# EasyEDA schematic child_easyeda.json
TITLE: Child Node, Wireless BMS; REV: 1.0; Date: 2023-08-22; Sheet: 1/1; Drawn By: Mathew Pellarin; Company: BMSLAB
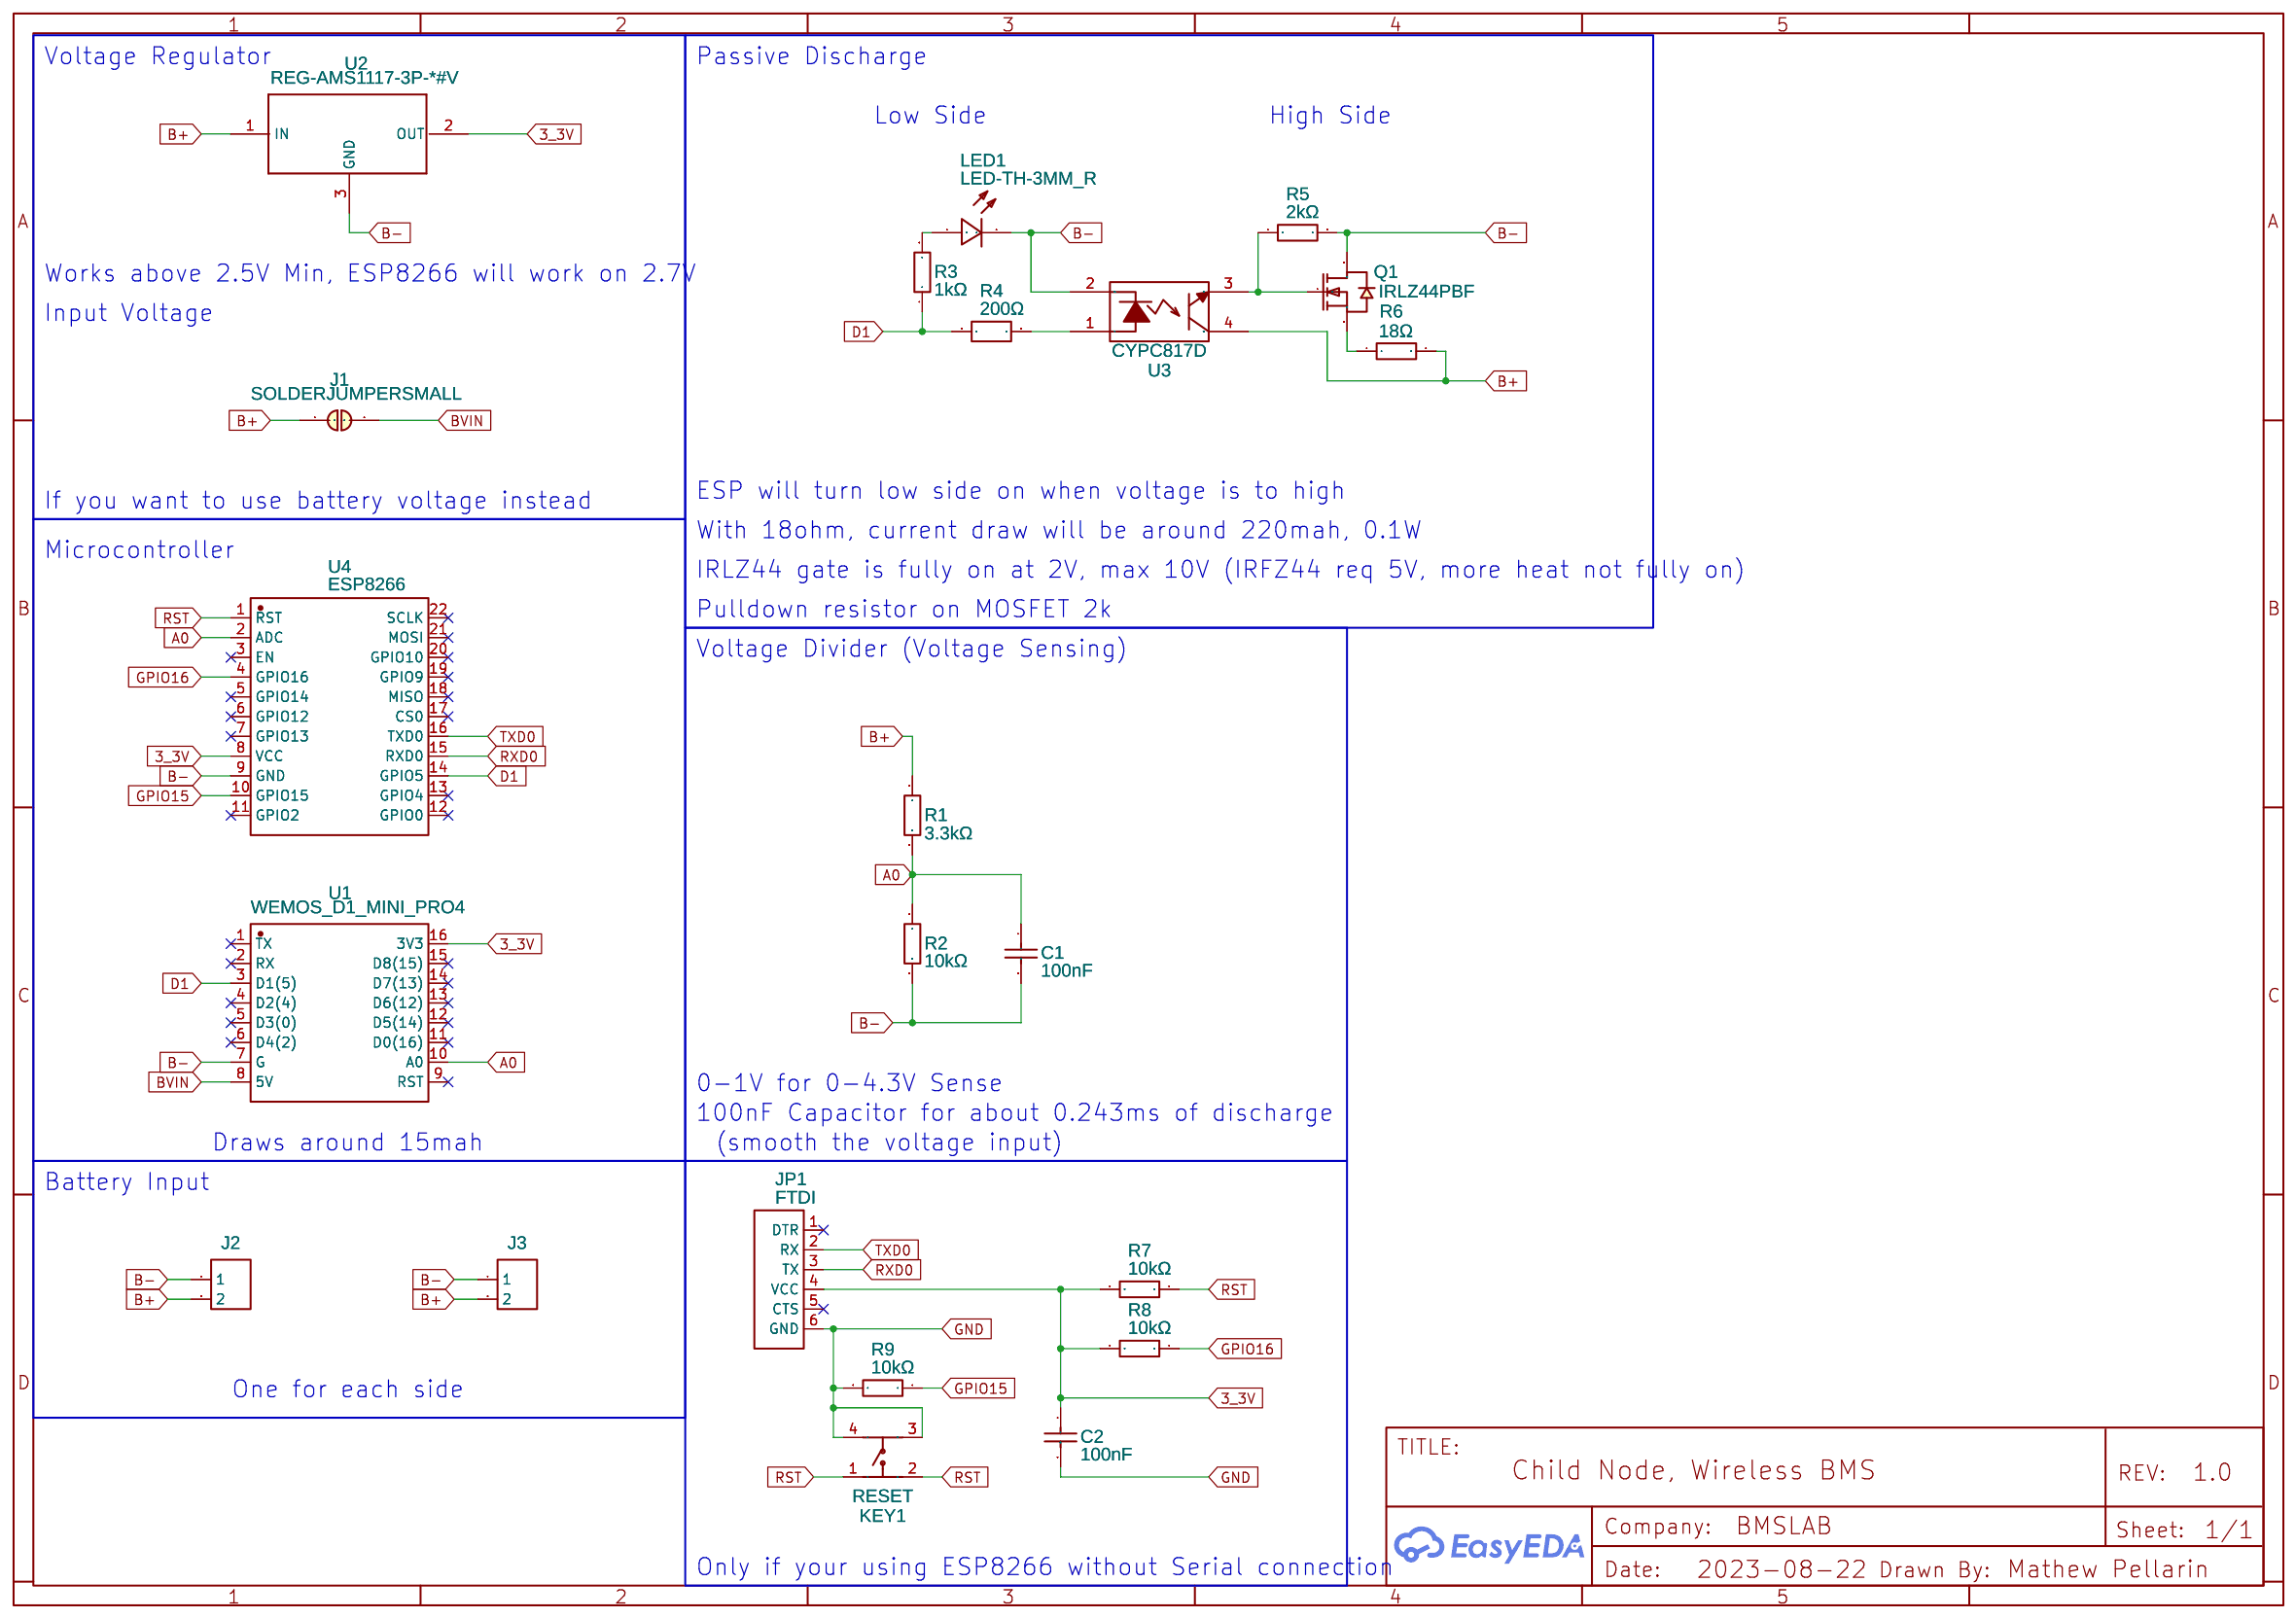
[diagram p0: schematic sheet]

## Parts
C1  100nF  [CAP-TH_L7.6-W3.8-P5.08-D0.51]
C2  100nF  [CAP-TH_L7.6-W3.8-P5.08-D0.51]
J1  SOLDERJUMPERSMALL  [SOLDERJUMPERSMALL]
J2  NO  [CONNECTOR_PINHEADER_2.54MM:PINHEADER_1X11_P_2.54MM]
J3  NO  [CONNECTOR_PINHEADER_2.54MM:PINHEADER_1X11_P_2.54MM]
JP1  FTDI  [FTDI]
KEY1  RESET  [KEY-TH_4P-L6.0-W6.0-P4.50-LS7.5]
LED1  LED-TH-3MM_R  [LED-TH_BD5.4-P2.54-FD_RED]
Q1  IRLZ44PBF  [TO-220AB-3_L10.4-W4.6-P2.54-L]
R1  3.3kΩ  [RES-TH_BD2.4-L6.3-P10.30-D0.6]
R2  10kΩ  [RES-TH_BD2.2-L6.5-P10.50-D0.6]
R3  1kΩ  [RES-TH_BD2.4-L6.3-P10.30-D0.6]
R4  200Ω  [RES-TH_BD2.7-L6.2-P10.20-D0.4]
R5  2kΩ  [RES-TH_BD2.4-L6.3-P10.30-D0.6]
R6  18Ω  [RES-TH_BD2.3-L6.5-P10.50-D0.5]
R7  10kΩ  [RES-TH_BD2.4-L6.3-P10.30-D0.6]
R8  10kΩ  [RES-TH_BD2.4-L6.3-P10.30-D0.6]
R9  10kΩ  [RES-TH_BD2.4-L6.3-P10.30-D0.6]
U1  WEMOS_D1_MINI_PRO4  [DIP-16_WEMOS_D1_MINI_PRO4]
U2  REG-AMS1117-3P-*#V  [REG-AMS1117-3P#V]
U3  CYPC817D  [DIP-4_L6.4-W4.6-P2.54-LS7.6-BL]
U4  ESP8266  [WIFIM-SMD_ESP-12F-ESP8266MOD]

## Library data of the parts
C1 C2 = SR305C105KAR: Contributor: LCSC; Supplier: LCSC; Supplier Part: C444741; Manufacturer: Kyocera AVX; JLCPCB Part Class: Extended Part; link: https://lcsc.com/eda_search?q=C444741&%26type=1&ref=editor
J1 = SOLDERJUMPERSMALL: Contributor: stefan.klaeui
J2 J3 = Header-Female-2.54_1x2: Supplier: LCSC; Manufacturer: BOOMELE; Manufacturer Part: Female headerHDR1X8-2.54; Supplier Part: C27438; JLCPCB Part Class: Extended Part; Contributor: Jacob KUNNATHOOR
JP1 = FTDI: Contributor: SparkFun
KEY1 = button6*6*8: Supplier Part: C59982; Supplier: LCSC; Manufacturer: ReliaPro; JLCPCB Part Class: Extended Part; link: https://lcsc.com/eda_search?q=C59982&%26type=1&ref=editor
LED1 = LED-TH-3MM_R: Contributor: LCSC; Supplier: LCSC; Supplier Part: C9900003210; Manufacturer: null; Manufacturer Part: LED-TH-3mm_R; JLCPCB Part Class: Extended Part; link: https://lcsc.com/eda_search?q=C9900003210&%26type=1&ref=editor
Q1 = IRLZ44PBF: Contributor: LCSC; Supplier: LCSC; Supplier Part: C2680731; Manufacturer: VBsemi(微碧); Manufacturer Part: IRLZ44PBF-VB; JLCPCB Part Class: Extended Part; link: https://lcsc.com/eda_search?q=C2680731&%26type=1&ref=editor
R1 R7-R9 = MFR-25FTE52-33K: Contributor: LCSC; Supplier: LCSC; Supplier Part: C173005; Manufacturer: YAGEO(国巨); JLCPCB Part Class: Extended Part; link: https://lcsc.com/eda_search?q=C173005&%26type=1&ref=editor
R2 = MFR-25FTE52-100K: Contributor: LCSC; Supplier: LCSC; Supplier Part: C172965; Manufacturer: YAGEO(国巨); JLCPCB Part Class: Extended Part; link: https://lcsc.com/eda_search?q=C172965&%26type=1&ref=editor
R3 = MFR50SFTE52-1K: Contributor: LCSC; Supplier: LCSC; Supplier Part: C173143; Manufacturer: YAGEO(国巨); JLCPCB Part Class: Extended Part; link: https://lcsc.com/eda_search?q=C173143&%26type=1&ref=editor
R4 = CR1/4W-200Ω±5%-ST52: Contributor: lcsc; Supplier: LCSC; Supplier Part: C2894669; Manufacturer: VO(翔胜); JLCPCB Part Class: Extended Part; link: https://lcsc.com/eda_search?q=C2894669&%26type=1&ref=editor
R5 = MFR-25FTE52-2K: Contributor: LCSC; Supplier: LCSC; Supplier Part: C172996; Manufacturer: YAGEO(国巨); JLCPCB Part Class: Extended Part; link: https://lcsc.com/eda_search?q=C172996&%26type=1&ref=editor
R6 = CF1/4W-18Ω±5% T52: Contributor: LCSC; Supplier: LCSC; Supplier Part: C120013; Manufacturer: CCO(千志电子); Manufacturer Part: CF1/4W-18Ω±5% T; JLCPCB Part Class: Extended Part; link: https://lcsc.com/eda_search?q=C120013&%26type=1&ref=editor
U1 = WEMOS_D1_MINI_PRO4: Contributor: LCSC; Supplier: LCSC; Supplier Part: C2837266; Manufacturer: null; Manufacturer Part: Wemos_D1_mini_Pro4; JLCPCB Part Class: Extended Part; link: https://lcsc.com/eda_search?q=C2837266&%26type=1&ref=editor
U2 = REG-AMS1117-3P-*#V: Contributor: jboutin
U3 = CYPC817D: Contributor: lcsc; Supplier: LCSC; Supplier Part: C3018787; Manufacturer: OCIC(卓睿科); JLCPCB Part Class: Extended Part; link: https://lcsc.com/eda_search?q=C3018787&%26type=1&ref=editor
U4 = ESP8266: LINK: https://img.jlc.com/image//data/smt-stock-produce/componentSizePhoto/2021-12-02/b5eb61357b2a478295008aee8c894ebd/BG2111290693_D21112900056_font.png; Contributor: LCSC; Supplier: LCSC; Supplier Part: C9900003049; Manufacturer: null; JLCPCB Part Class: Extended Part; link: https://lcsc.com/eda_search?q=C9900003049&%26type=1&ref=editor

## Nets
GND: C2.2 JP1.6(GND) KEY1.3 KEY1.4 R9.2
3_3V: C2.1 JP1.4(VCC) R7.2 R8.2 U1.16(3V3) U2.2(OUT) U4.8(VCC)
A0: C1.1 R1.2 R2.1 U1.10(A0) U4.2(ADC)
B+: J1.1 J2.2 J3.2 R1.1 R6.2 U2.1(IN) U3.4(COL)
B-: C1.2 J2.1 J3.1 LED1.2 Q1.2(D) R2.2 R5.2 U1.7(G) U2.3(GND) U3.2(CAT) U4.9(GND)
BVIN: J1.2 U1.8(5V)
D1: R3.1 R4.1 U1.3(D1(5)) U4.14(GPIO5)
GPIO15: R9.1 U4.10(GPIO15)
GPIO16: R8.1 U4.4(GPIO16)
RST: KEY1.1 KEY1.2 R7.1 U4.1(RST)
RXD0: JP1.3(TX) U4.15(RXD0)
TXD0: JP1.2(RX) U4.16(TXD0)
Net-(LED1-1): LED1.1 R3.2
Net-(Q1-1): Q1.1(G) R5.1 U3.3(EM)
Net-(Q1-3): Q1.3(S) R6.1
Net-(R4-2): R4.2 U3.1(AN)

Not connected (* = marked no-connect by the designer): JP1 1(DTR)* 5(CTS)*; U1 1(TX)* 2(RX)* 4(D2(4))* 5(D3(0))* 6(D4(2))* 9(RST)* 11(D0(16))* 12(D5(14))* 13(D6(12))* 14(D7(13))* 15(D8(15))*; U4 3(EN)* 5(GPIO14)* 6(GPIO12)* 7(GPIO13)* 11(GPIO2)* 12(GPIO0)* 13(GPIO4)* 17(CS0)* 18(MISO)* 19(GPIO9)* 20(GPIO10)* 21(MOSI)* 22(SCLK)*

## Notes on the sheet
- Voltage Regulator
- Passive Discharge
- Low Side
- High Side
- Works above 2.5V Min, ESP8266 will work on 2.7V
- Input Voltage
- If you want to use battery voltage instead
- ESP will turn low side on when voltage is to high
- With 18ohm, current draw will be around 220mah, 0.1W
- Microcontroller
- IRLZ44 gate is fully on at 2V, max 10V (IRFZ44 req 5V, more heat not fully on)
- Pulldown resistor on MOSFET 2k
- Voltage Divider (Voltage Sensing)
- 0-1V for 0-4.3V Sense
- 100nF Capacitor for about 0.243ms of discharge
- Draws around 15mah
- (smooth the voltage input)
- Battery Input
- One for each side
- Only if your using ESP8266 without Serial connection
